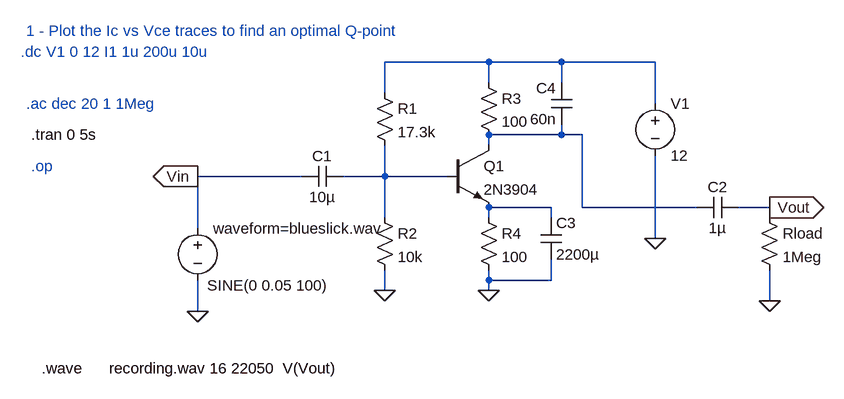
[diagram p0: schematic class_A_amp.asc]
class_A_amp.asc, the LTspice schematic file:
Version 4
SHEET 1 1060 680
WIRE 448 112 288 112
WIRE 560 112 448 112
WIRE 704 112 560 112
WIRE 448 144 448 112
WIRE 560 144 560 112
WIRE 288 160 288 112
WIRE 704 176 704 112
WIRE 560 224 560 208
WIRE 560 224 448 224
WIRE 592 224 560 224
WIRE 448 240 448 224
WIRE 160 288 0 288
WIRE 288 288 288 240
WIRE 288 288 224 288
WIRE 384 288 288 288
WIRE 544 336 448 336
WIRE 592 336 592 224
WIRE 768 336 592 336
WIRE 880 336 832 336
WIRE 288 352 288 288
WIRE 448 352 448 336
WIRE 544 352 544 336
WIRE 880 352 880 336
WIRE 0 368 0 288
WIRE 704 384 704 256
WIRE 448 448 448 432
WIRE 544 448 544 416
WIRE 544 448 448 448
WIRE 288 464 288 432
WIRE 448 464 448 448
WIRE 880 480 880 432
WIRE 0 496 0 448
FLAG 704 384 0
FLAG 448 464 0
FLAG 288 464 0
FLAG 0 496 0
FLAG 880 480 0
FLAG 880 336 Vout
IOPIN 880 336 Out
FLAG 0 288 Vin
IOPIN 0 288 Out
SYMBOL npn 384 240 R0
SYMATTR InstName Q1
SYMATTR Value 2N3904
SYMBOL voltage 704 160 R0
SYMATTR InstName V1
SYMATTR Value 12
SYMBOL res 272 144 R0
SYMATTR InstName R1
SYMATTR Value 17.3k
SYMBOL res 272 336 R0
SYMATTR InstName R2
SYMATTR Value 10k
SYMBOL res 432 128 R0
SYMATTR InstName R3
SYMATTR Value 100
SYMBOL res 432 336 R0
SYMATTR InstName R4
SYMATTR Value 100
SYMBOL cap 224 272 R90
WINDOW 0 0 32 VBottom 2
WINDOW 3 32 32 VTop 2
SYMATTR InstName C1
SYMATTR Value 10µ
SYMBOL cap 832 320 R90
WINDOW 0 0 32 VBottom 2
WINDOW 3 32 32 VTop 2
SYMATTR InstName C2
SYMATTR Value 1µ
SYMBOL voltage 0 352 R0
WINDOW 3 15 104 Left 2
SYMATTR InstName waveform=blueslick.wav
SYMATTR Value SINE(0 0.05 100)
SYMATTR Value2 AC 1
SYMBOL res 864 336 R0
SYMATTR InstName Rload
SYMATTR Value 1Meg
SYMBOL cap 528 352 R0
SYMATTR InstName C3
SYMATTR Value 2200µ
SYMBOL cap 576 208 R180
WINDOW 0 24 56 Left 2
WINDOW 3 24 8 Left 2
SYMATTR InstName C4
SYMATTR Value 60n
TEXT -272 96 Left 2 ;.dc V1 0 12 I1 1u 200u 10u
TEXT -264 64 Left 2 ;1 - Plot the Ic vs Vce traces to find an optimal Q-point
TEXT -264 176 Left 2 ;.ac dec 20 1 1Meg
TEXT -256 224 Left 2 !.tran 0 5s
TEXT -256 272 Left 2 ;.op
TEXT -240 584 Left 2 !.wave      recording.wav 16 22050  V(Vout)

The netlist it stands for:
* class_A_amp.asc
Q1 N002 N003 N004 0 2N3904
V1 N001 0 12
R1 N001 N003 17.3k
R2 N003 0 10k
R3 N001 N002 100
R4 N004 0 100
C1 N003 Vin 10µ
C2 Vout N002 1µ
V§waveform=blueslick.wav Vin 0 SINE(0 0.05 100) AC 1
Rload Vout 0 1Meg
C3 N004 0 2200µ
C4 N002 N001 60n
.model NPN NPN
.model PNP PNP
.lib standard.bjt
* .dc V1 0 12 I1 1u 200u 10u
* 1 - Plot the Ic vs Vce traces to find an optimal Q-point
* .ac dec 20 1 1Meg
.tran 0 5s
* .op
.wave      recording.wav 16 22050  V(Vout)
.backanno
.end